# EAGLE design MainBoard 1.5.2 (EAGLE 9.6.2)
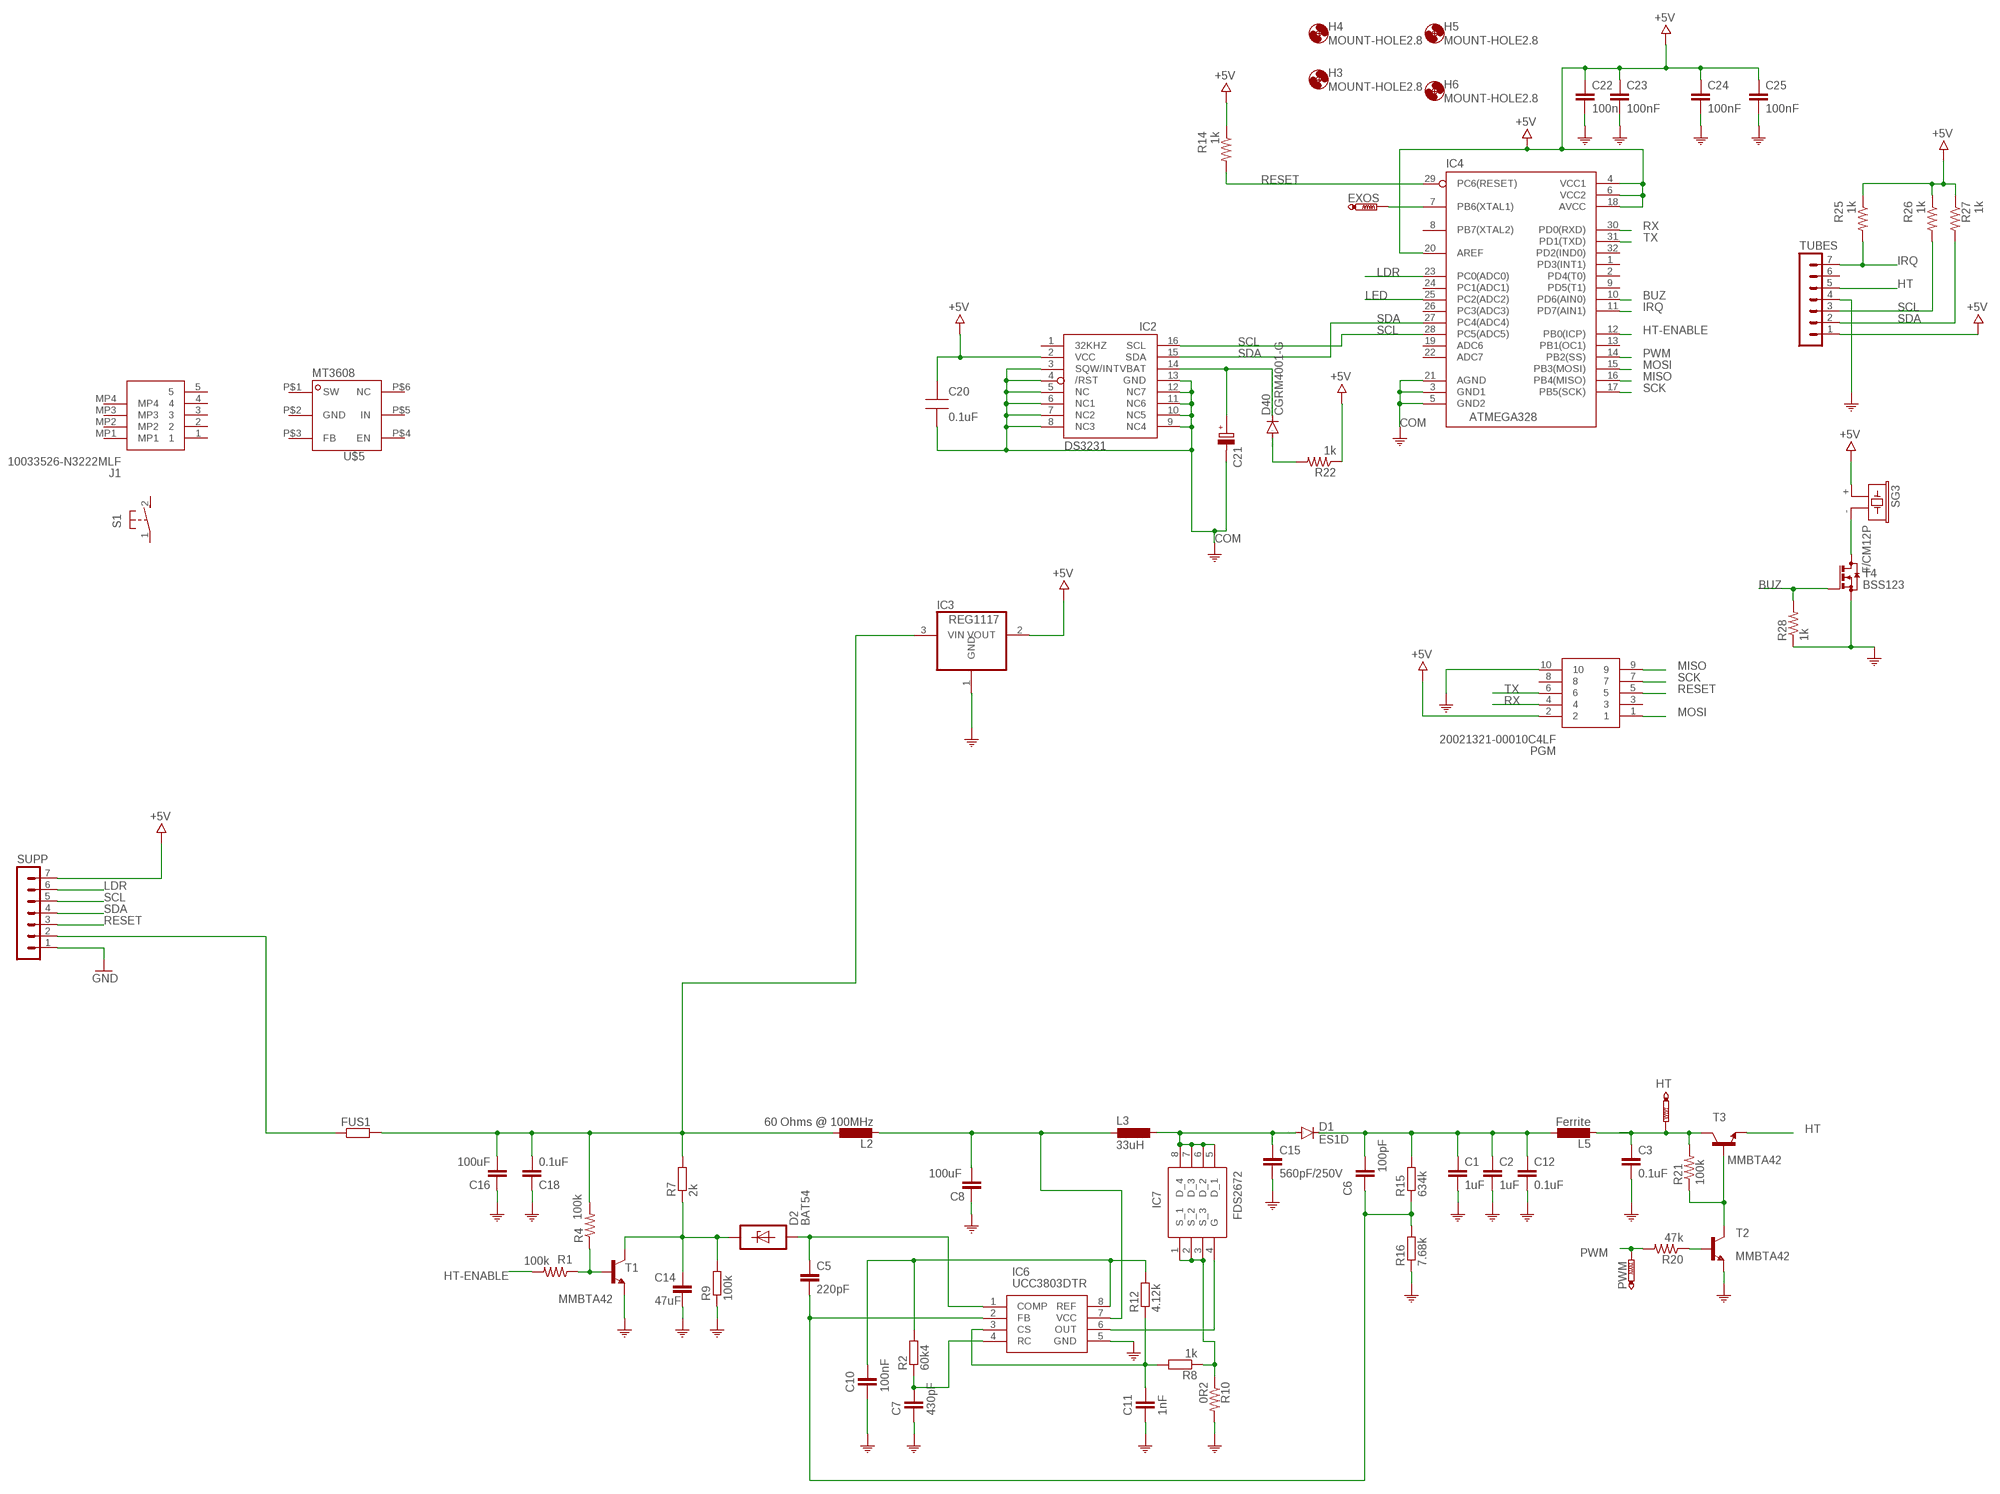
[diagram p0: schematic, sheet 1]

## Parts
C1  1uF  C-EUC1812K  [C1812K]
C2  1uF  C-EUC1812K  [C1812K]
C3  0.1uF  C-EUC1808  [C1808]
C5  220pF  C-EUC0805K  [C0805K]
C6  100pF  C-EUC0805  [C0805]
C7  430pF  C-EUC0805  [C0805]
C8  100uF  C-EUC1210  [C1210]
C10  100nF  C-EUC0805  [C0805]
C11  1nF  C-EUC0805  [C0805]
C12  0.1uF  C-EUC1808  [C1808]
C14  47uF  C-EUC1210  [C1210]
C15  560pF/250V  C-EUC0603  [C0603]
C16  100uF  C-EUC1210  [C1210]
C18  0.1uF  C-EUC0805  [C0805]
C20  0.1uF  CAP0805-NP  [CAP0805-NP]
C21  AHG-35/100-RADIAL  [ELNA21.5X8.0]
C22  100n  C-EUC0603  [C0603]
C23  100nF  C-EUC0603  [C0603]
C24  100nF  C-EUC0603  [C0603]
C25  100nF  C-EUC0603  [C0603]
D1  ES1D  ES2D  [SMB]
D2  BAT54  SP4020-01FTG  [SOD323]
D40  CGRM4001-G  [SOD-123_MINI-SMA]
EXOS  PTR1TP09R  [TP09R]
FUS1  R-EU_R6332  [R6332]
H3  MOUNT-HOLE2.8  [2,8]
H4  MOUNT-HOLE2.8  [2,8]
H5  MOUNT-HOLE2.8  [2,8]
H6  MOUNT-HOLE2.8  [2,8]
HT  PTR1TP09R  [TP09R]
IC2  DS3231/SO  [SO16W]
IC3  REG1117  [SOT223]
IC4  ATMEGA328  ATMEGA168-20AU  [QFP032]
IC6  UCC3803DTR  [SOIC127P600X175-8N]
IC7  FDS2672  [SOIC127P600X175-8N]
J1  10033526-N3222MLF  [10033526N3222MLF]
L2  60 Ohms @ 100MHz  L-EUL2012C  [L2012C]
L3  33uH  MSS7341  [MSS7341]
L5  Ferrite  L-EUL2012C  [L2012C]
PGM  20021321-00010C4LF  [2002132100010C4LF]
PWM  PTR1TP09R  [TP09R]
R1  100k  R-US_R0805  [R0805]
R2  60k4  R-EU_R0805  [R0805]
R4  100k  R-US_R0805  [R0805]
R7  2k  R-EU_R0805  [R0805]
R8  1k  R-EU_R0805  [R0805]
R9  100k  R-EU_R0805  [R0805]
R10  0R2  R-US_R2010  [R2010]
R12  4.12k  R-EU_R0805  [R0805]
R14  1k  R-US_M2012  [M2012]
R15  634k  R-EU_R0805  [R0805]
R16  7.68k  R-EU_R0805  [R0805]
R20  47k  R-US_R2012  [R2012]
R21  100k  R-US_R2012  [R2012]
R22  1k  R-US_M2012  [M2012]
R25  1k  R-US_M2012  [M2012]
R26  1k  R-US_M2012  [M2012]
R27  1k  R-US_M2012  [M2012]
R28  1k  R-US_M2012  [M2012]
S1  31-XX  [B3F-31XX]
SG3  F/CM12P  [F/CM12P]
SUPP  MA07-1  [MA07-1]
T1  MMBTA42  BC846  [SOT23]
T2  MMBTA42  BC846  [SOT23]
T3  MMBTA42  BC846  [SOT23]
T4  BSS123  [SOT23]
TUBES  MA07-1  [MA07-1]
U$5  MT3608SOT23-6  [SOT23-6]

## Nets
+5V [pwr]: C20.1 C22.1 C23.1 C24.1 C25.1 IC2.2(VCC) IC3.2(VOUT) IC4.4(VCC1) IC4.6(VCC2) IC4.18(AVCC) IC4.20(AREF) PGM.2 R14.1 R22.1 R25.1 R26.1 R27.1 SG3.+ SUPP.7 TUBES.1
BATT: C21.+ D40.C IC2.14(VBAT)
BUZ: IC4.10(PD6(AIN0)) R28.2 T4.1(G)
COM: C1.2 C2.2 C3.2 C7.2 C8.1 C10.2 C11.2 C12.2 C14.2 C15.2 C16.1 C18.2 C20.2 C21.- C22.2 C23.2 C24.2 C25.2 IC2.3(SQW/INT) IC2.4(/RST) IC2.5(NC) IC2.6(NC1) IC2.7(NC2) IC2.8(NC3) IC2.9(NC4) IC2.10(NC5) IC2.11(NC6) IC2.12(NC7) IC2.13(GND) IC3.1(GND) IC4.3(GND1) IC4.5(GND2) IC4.21(AGND) IC6.5(GND) PGM.10 R9.1 R10.2 R16.1 R28.1 SUPP.1 T1.2(E) T2.2(E) T4.2(S) TUBES.4 ; supply symbol labelled GND
CS: C11.1 IC6.3(CS) R8.2 R12.1
FB: C5.2 C6.2 IC6.2(FB) R15.1 R16.2
HT: T3.2(E) TUBES.5
HT-ENABLE: IC4.12(PB0(ICP)) R1.2
IRQ: IC4.11(PD7(AIN1)) R25.2 TUBES.7
LDR: IC4.23(PC0(ADC0)) SUPP.6
LED: IC4.25(PC2(ADC2))
MISO: IC4.16(PB4(MISO)) PGM.9
MOSI: IC4.15(PB3(MOSI)) PGM.1
N$3: SG3.- T4.3(D)
N$5: EXOS.TP IC4.7(PB6(XTAL1))
N$6: C1.1 C2.1 C6.1 C12.1 D1.C L5.1 R15.2
N$7: R21.1 T2.3(C) T3.1(B)
N$8: R1.1 R4.1 T1.1(B)
N$9: C14.1 D2.C R7.1 R9.2 T1.3(C)
N$10: C5.1 D2.A IC6.1(COMP)
N$12: IC7.1(S_1) IC7.2(S_2) IC7.3(S_3) R8.1 R10.1
N$14: C8.2 IC6.7(VCC) L2.2 L3.1
N$18: C15.1 D1.A IC7.5(D_1) IC7.6(D_2) IC7.7(D_3) IC7.8(D_4) L3.2
N$19: R20.1 T2.1(B)
N$23: D40.A R22.2
OUT: IC6.6(OUT) IC7.4(G)
POSTFUSE [pwr]: C16.2 C18.1 FUS1.2 IC3.3(VIN) L2.1 R4.2 R7.2
PWM: IC4.14(PB2(SS)) PWM.TP R20.2
RAW_HT: C3.1 HT.TP L5.2 R21.2 T3.3(C)
RC: C7.1 IC6.4(RC) R2.1
REF: C10.1 IC6.8(REF) R2.2 R12.2
RESET: IC4.29(PC6(RESET)) PGM.5 R14.2 SUPP.3
RX: IC4.30(PD0(RXD)) PGM.4
SCK: IC4.17(PB5(SCK)) PGM.7
SCL: IC2.16(SCL) IC4.28(PC5(ADC5)) R26.2 SUPP.5 TUBES.3
SDA: IC2.15(SDA) IC4.27(PC4(ADC4)) R27.2 SUPP.4 TUBES.2
TX: IC4.31(PD1(TXD)) PGM.6
VBUS: FUS1.1 SUPP.2
Unconnected: IC2.1(32KHZ) IC4.1(PD3(INT1)) IC4.2(PD4(T0)) IC4.8(PB7(XTAL2)) IC4.9(PD5(T1)) IC4.13(PB1(OC1)) IC4.19(ADC6) IC4.22(ADC7) IC4.24(PC1(ADC1)) IC4.26(PC3(ADC3)) IC4.32(PD2(IND0)) J1.1 J1.2 J1.3 J1.4 J1.5 J1.MP1 J1.MP2 J1.MP3 J1.MP4 PGM.3 PGM.8 S1.1(P) S1.2(S) TUBES.6 U$5.P$1(SW) U$5.P$2(GND) U$5.P$3(FB) U$5.P$4(EN) U$5.P$5(IN) U$5.P$6(NC)

## Library data of the parts
C1 C2 = rcl:C-EU: CAPACITOR, European symbol; MOUSER: 810-C4532X7T2E105MST; SPICEPREFIX: C; TDK: C4532X7T2E105M250KE
C3 C12 = rcl:C-EU: CAPACITOR, European symbol; KEMET: CAN17C104KARACTU; MOUSER: 80-CAN17C104KARACTU; SPICEPREFIX: C
C5 C14 C15 C18 C22-C25 = rcl:C-EU: CAPACITOR, European symbol; SPICEPREFIX: C
C6 C7 C10 C11 = rcl:C-EU: CAPACITOR, European symbol; MOUSER: 791-0603X106K100CT; SPICEPREFIX: C
C8 C16 = rcl:C-EU: CAPACITOR, European symbol; MOUSER: 963-EMK325ABJ107MM-P; SPICEPREFIX: C; TAIYO_YUDEN: EMK325ABJ107MM-P
C20 = MySMD:CAP0805-NP
C21 = Elkos:AHG-35/100-RADIAL: AUDYN® - AHG Gepolt, radial High Grade AHG Gepolter Elekrolytkondensator für Audio-Netzteile, oder Verstärker im Home- und Car-Bereich. Technische Daten Anschlußdrähte: Kupfer, verzinnt AL: ? mm d2ø : ? mm Kapazitätsbereich: von 10 µF bis 2200 µF Nennspannungen: 25 V, 35 V, 50 V, 100 V C-Toleranz: 20 % ( bei 20° C ) Verlustfaktor: tan δ < 0,100 @ 1 kHz Temperaturbereich: - 40° C bis 85° C Verzerrung: sehr gering bei 10 kHz, 010 A - 120 dB oder niedriger gepolt AHG AUDYN® - AHG gepolt Bezeichnung C U DxH Rm Bestell.-Nr. U / Volt D x L/mm mm AHG/10.0/100V 10µF 100V 10x15 5,0 1341690 AHG/22.0/50V 22µF 50V 10x13 5,0 1341691 AHG/47.0/50V 47µF 50V 10x16 5,0 1341692 AHG/100.0/50V 100µF 50V 13x21 5,0 1341693 AHG/220.0/50V 220µF 50V 16x25 7,5 1341694 AHG/470.0/50V 470µF 50V 16x37 7,5 1341695 AHG/1000/35V 1000µF 35V 18x37 7,5 1341696 AHG/2200/35V 2200µF 35V 22x38 10,0 1341697 Alle Abmessungen in mm; MOUSER: 555-DB-5R5D474T
D1 = diode:ES2D: DIODE super fast rectifier, 2 A
D2 = sp4020_11:SP4020-01FTG: SP4020 Series 2.5pF, 30A Discrete TVS Diode Source: http://www.littelfuse.com/~/media/electronics/datasheets/tvs_diode_arrays/littelfuse_tvs_diode_array_sp4020_datasheet.pdf.pdf; MF: Littelfuse; MPN: SP4020-01FTG; OC_FARNELL: unknown; OC_NEWARK: 05X0400
D40 = diode:CGRM400*-G: Molded plasitc,JEDEC SOD-123/Mini SMA Source: Comchip CGRM4001-G.pdf; MOUSER: 863-NSR0320MW2T1G
EXOS HT PWM = testpad:PTR1: TEST PIN
FUS1 = rcl:R-EU_: RESISTOR, European symbol; MOUSER: 530-0ZCG0150AF2C; SPICEPREFIX: R
H3-H6 = holes:MOUNT-HOLE: MOUNTING HOLE with drill center marker
IC2 = DS3231:DS3231; AVAILABILITY: Unavailable; MF: Maxim Integrated; MOUSER: 700-DS3231S#; MP: DS3231; PACKAGE: SOIC-16 Maxim Integrated; PRICE: None
IC3 = burr-brown:REG1117: 800mA and 1A Low Dropout (LDO) Positive Regulator 1.8V, 2.5V, 2.85V, 3.3V, 5V, and Adj; MPN: REG1117; OC_FARNELL: 1097566; OC_NEWARK: 14P6981
IC4 = MySMD:ATMEGA168-20AU
IC6 = UCC3803DTR:UCC3803DTR: Switching Controllers Low-Power BiCMOS Current-Mode PWM Source: Datasheet <http://www.ti.com/lit/ds/symlink/ucc3803.pdf>; DESCRIPTION: Switching Controllers Low-Power BiCMOS Current-Mode PWM; HEIGHT: 1.75mm; MANUFACTURER_NAME: Texas Instruments; MANUFACTURER_PART_NUMBER: UCC3803DTR; MOUSER_PART_NUMBER: 595-UCC3803DTR; MOUSER_PRICE-STOCK: https://www.mouser.com/Search/Refine.aspx?Keyword=595-UCC3803DTR
IC7 = FDS2672:FDS2672: FDS2672, N-channel MOSFET Transistor 3.9 A 200 V, 8-Pin SOIC Source: Datasheet <http://docs-emea.rs-online.com/webdocs/0d23/0900766b80d23481.pdf>; DESCRIPTION: FDS2672, N-channel MOSFET Transistor 3.9 A 200 V, 8-Pin SOIC; HEIGHT: 1.75mm; MANUFACTURER_NAME: Fairchild Semiconductor; MANUFACTURER_PART_NUMBER: FDS2672; MOUSER_PART_NUMBER: 512-FDS2672; MOUSER_PRICE-STOCK: https://www.mouser.com/Search/Refine.aspx?Keyword=512-FDS2672; RS_PART_NUMBER: 6710481P; RS_PRICE-STOCK: http://uk.rs-online.com/web/p/products/6710481P
J1 = SamacSys_Parts:10033526-N3222MLF: USB Connectors 10033526-N3222MLF-MINI USB B TYPE RECEPT. Source: Datasheet <https://componentsearchengine.com/Datasheets/1/10033526-N3222MLF.pdf>; DESCRIPTION: USB Connectors 10033526-N3222MLF-MINI USB B TYPE RECEPT.; HEIGHT: 3.95mm; MANUFACTURER_NAME: Amphenol; MANUFACTURER_PART_NUMBER: 10033526-N3222MLF; MOUSER_PART_NUMBER: 649-10033526N3222MLF; MOUSER_PRICE-STOCK: https://www.mouser.co.uk/ProductDetail/Amphenol-FCI/10033526-N3222MLF?qs=LmzVcvYPptRriY26yhJP4g%3D%3D
L2 L5 = rcl:L-EU: INDUCTOR, European symbol; SPICEPREFIX: L
L3 = STEAM-inductor-coilcraft:MSS7341: Shielded Power Inductors Package 6.6 × 6.6 mm x 4.1 mm high Source: http://www.farnell.com/datasheets/1681958.pdf; MOUSER: 710-784770330
PGM = SamacSys_Parts:20021321-00010C4LF: Headers & Wire Housings 1.27x1.27mm BTB, Hdr Recept, SMT, 10 Pos Source: Datasheet <https://componentsearchengine.com/Datasheets/1/20021321-00010C4LF.pdf>; DESCRIPTION: Headers & Wire Housings 1.27x1.27mm BTB, Hdr Recept, SMT, 10 Pos; HEIGHT: 4.75mm; MANUFACTURER_NAME: Amphenol; MANUFACTURER_PART_NUMBER: 20021321-00010C4LF; MOUSER_PART_NUMBER: 649-202132100010C4LF; MOUSER_PRICE-STOCK: https://www.mouser.com/Search/Refine.aspx?Keyword=649-202132100010C4LF
R1 R4 R10 R14 R20-R22 R25-R28 = adafruit:R-US_: RESISTOR, American symbol
R2 R8 R9 = rcl:R-EU_: RESISTOR, European symbol; SPICEPREFIX: R
R7 = rcl:R-EU_: RESISTOR, European symbol; MOUSER: 754-RR1220P-202D; SPICEPREFIX: R; SUSUMU: RR1220P-202-D
R12 = rcl:R-EU_: RESISTOR, European symbol; KOASPEER: RN732ATTD4121F100; MOUSER: 660-RN732ATD4121F100; SPICEPREFIX: R
R15 = rcl:R-EU_: RESISTOR, European symbol; MOUSER: 71-CRCW0603-634K-E3; SPICEPREFIX: R; VISHAY: CRCW0603634KFKEA
R16 = rcl:R-EU_: RESISTOR, European symbol; MOUSER: 71-CRCW0805-7.68K-E3; SPICEPREFIX: R; VISHAY: CRCW08057K68FKEA
S1 = switch-omron:31-XX: OMRON SWITCH; MPN: B3F-3100; OC_FARNELL: 959704; OC_NEWARK: 36M3582
SG3 = buzzer:F/CM12P: BUZZER Source: Buerklin; OC_FARNELL: unknown; OC_NEWARK: unknown
SUPP TUBES = con-lstb:MA07-1: PIN HEADER; OC_FARNELL: unknown; OC_NEWARK: unknown
T1-T3 = transistor:BC846: NPN TRANSISTOR
T4 = transistor-small-signal:BSS123: N-CHANNEL MOS FET
U$5 = MT3608:MT3608: MT3608 High Efficiency 1.2MHz 2A Step Up Converter BY: Rangana Tennakoon

## Module TUBEIN16
Ports: 

### Library data of the parts

## Net classes
0 default: width 0.254 mm, clearance 0.254 mm
1 pwr: width 0.254 mm, clearance 0.356 mm

## Board
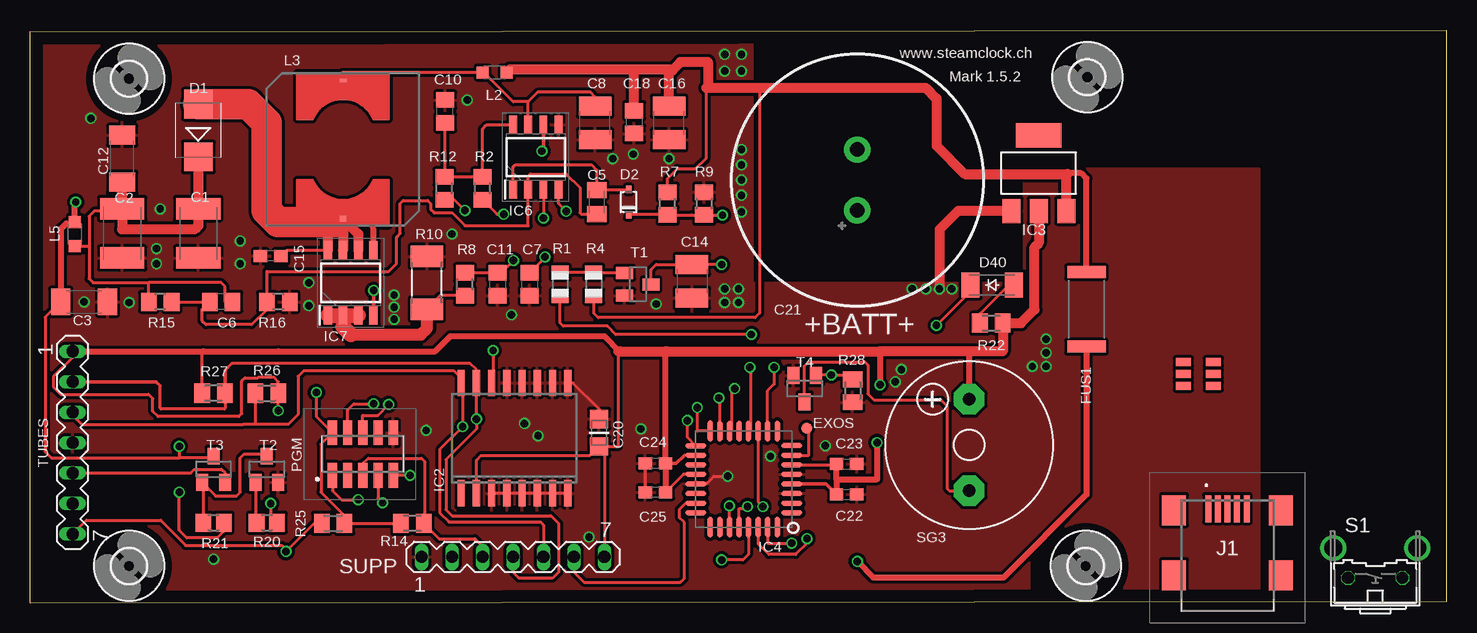
[diagram p1: board, top side]
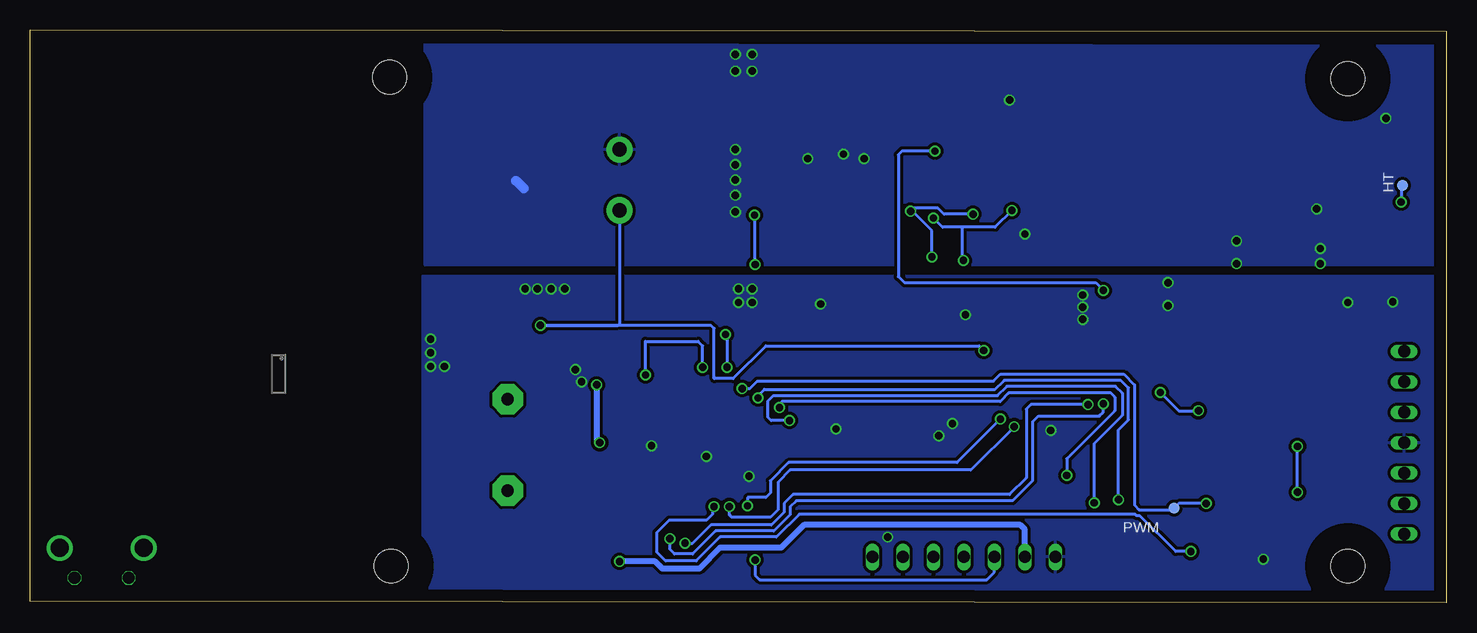
[diagram p2: board, bottom side, seen from below]

Size 118.11 x 47.75 mm. Coordinates in mm from the lower left corner, seen from the top.
Outline: 0,47.62 118.11,47.75 118.11,0.13 0,0 0,47.62
Copper layers (1*16): Top 0.035mm / dielectric 1.5mm / Bottom 0.035mm
Design rules "default *": minimum track width 10mil, minimum drill 24mil, track to track 4mil, track to pad 1mil, pad to pad 1mil, via to via 8mil, smd to smd 8mil, copper to edge 40mil, drill to drill 8mil, minimum pad ring 1mil, minimum via ring 3mil, stop-mask expansion 4mil, vias tented up to drill 0mil, thermal gap 10mil

### Footprints (pad centres in the part's own frame; a part is rotated, then mirrored left to right if it is on the bottom)
C1812K = smd 1.8 x 3.7: 1 -2.05,0; 2 2.05,0
C1808 = smd 1.6 x 2.2: 1 -1.95,0; 2 1.95,0
C0805K = smd 1.3 x 1.6: 1 -1,0; 2 1,0
C0805 = smd 1.3 x 1.5: 1 -0.95,0; 2 0.95,0
C1210 = smd 1.6 x 2.7: 1 -1.4,0; 2 1.4,0
C0603 = smd 1.1 x 1: 1 -0.85,0; 2 0.85,0
CAP0805-NP = smd 1.524 x 1.524: 1 0,0; 2 2.286,0
ELNA21.5X8.0 = drill 1.2 pad 2.184: + -2.54,0; - 2.54,0
SMB = smd 2.4 x 2.4: A 2.2,0; C -2.2,0
SOD323 = smd 0.6 x 0.45: A 1.06,0; C -1.06,0
SOD-123_MINI-SMA = smd 1.5 x 2.1: A 1.8,0; C -1.8,0
TP09R = smd 0.9 x 0.9: TP 0,0
R6332 = smd 1 x 3.2: 1 -3.1,0; 2 3.1,0
2,8 = hole 2.8: 0,0
SO16W = smd 0.6 x 2.2: 1 -4.445,-4.6; 2 -3.175,-4.6; 3 -1.905,-4.6; 4 -0.635,-4.6; 5 0.635,-4.6; 6 1.905,-4.6; 7 3.175,-4.6; 8 4.445,-4.6; 9 4.445,4.6; 10 3.175,4.6; 11 1.905,4.6; 12 0.635,4.6; 13 -0.635,4.6; 14 -1.905,4.6; 15 -3.175,4.6; 16 -4.445,4.6
SOT223 = smd 1.499 x 2.007: 1 -2.261,-3.15; 2 0.025,-3.15; 3 2.311,-3.15 | smd 3.81 x 2.007: 4 0,3.15
QFP032 = smd 0.432 x 1.778: 1 0,0; 2 0.8,0; 3 1.599,0; 4 2.399,0; 5 3.199,0; 6 3.998,0; 7 4.798,0; 8 5.598,0; 17 5.588,8.001; 18 4.798,7.997; 19 3.998,7.997; 20 3.199,7.997; 21 2.399,7.997; 22 1.599,7.997; 23 0.799,7.997; 24 0,7.997 | smd 1.778 x 0.432: 9 6.807,1.194; 10 6.807,2.007; 11 6.807,2.794; 12 6.807,3.607; 13 6.807,4.394; 14 6.807,5.182; 15 6.807,5.994; 16 6.816,6.803; 25 -1.194,6.807; 26 -1.194,5.994; 27 -1.194,5.182; 28 -1.194,4.394; 29 -1.194,3.607; 30 -1.194,2.794; 31 -1.194,2.007; 32 -1.194,1.194
SOIC127P600X175-8N = smd 1.525 x 0.65: 1 -2.712,1.905; 2 -2.712,0.635; 3 -2.712,-0.635; 4 -2.712,-1.905; 5 2.712,-1.905; 6 2.712,-0.635; 7 2.712,0.635; 8 2.712,1.905
SOIC127P600X175-8N' = smd 1.525 x 0.7: 1 -2.712,1.905; 2 -2.712,0.635; 3 -2.712,-0.635; 4 -2.712,-1.905; 5 2.712,-1.905; 6 2.712,-0.635; 7 2.712,0.635; 8 2.712,1.905
10033526N3222MLF = smd 0.5 x 2.25: 1 -1.6,5.545; 2 -0.8,5.545; 3 0,5.545; 4 0.8,5.545; 5 1.6,5.545 | smd 2 x 2.5: MP1 -4.45,5.42; MP2 -4.45,0; MP3 4.45,0; MP4 4.45,5.42
L2012C = smd 1 x 1: 1 -1,0; 2 1,0
MSS7341 = smd 0.61 x 0.305: 1 0,5.765 | smd 0.5 x 0.5: 2 0,-5.765
2002132100010C4LF = smd 0.76 x 2.05: 1 2.54,1.775; 2 2.54,-1.775; 3 1.27,1.775; 4 1.27,-1.775; 5 0,1.775; 6 0,-1.775; 7 -1.27,1.775; 8 -1.27,-1.775; 9 -2.54,1.775; 10 -2.54,-1.775
R0805 = smd 1.1 x 1.4: 1 -1,0; 2 1,0
R0805' = smd 1.3 x 1.5: 1 -0.95,0; 2 0.95,0
R2010 = smd 1.8 x 2.7: 1 -2.2,0; 2 2.2,0
M2012 = smd 1.3 x 1.6: 1 -0.95,0; 2 0.95,0
R2012 = smd 1.3 x 1.5: 1 -0.85,0; 2 0.85,0
B3F-31XX = drill 1.016 octagon: 1 -2.261,-1.245; 2 2.261,-1.245 | drill 1.499 pad 2.159: 3 -3.505,1.245; 4 3.505,1.245
F/CM12P = drill 1.016 pad 2.54 octagon: + 3.81,0; - -3.81,0
MA07-1 = drill 1.016 long: 1 -7.62,0; 2 -5.08,0; 3 -2.54,0; 4 0,0; 5 2.54,0; 6 5.08,0; 7 7.62,0
SOT23 = smd 1 x 1.4: 1 -0.95,-1.1; 2 0.95,-1.1; 3 0,1.1
SOT23-6 = smd 1.27 x 0.635: P$1 0,0; P$2 0,-1; P$3 0,-2; P$4 2.5,-2; P$5 2.5,-1; P$6 2.5,0

### Placement (x,y rotation side)
C1  14.03,30.8 270 top
C2  7.68,30.8 270 top
C3  4.51,25.08 0 top
C5  47.24,33.4 270 top
C6  15.94,25.08 180 top
C7  41.66,26.54 270 top
C8  47.12,40.01 90 top
C10  34.61,40.96 90 top
C11  38.99,26.54 270 top
C12  7.68,37.02 90 top
C14  55.18,26.8 270 top
C15  20.07,28.89 180 top
C16  53.28,40.01 90 top
C18  50.36,40.07 270 top
C20  47.43,13.02 90 top
C21  68.96,35.24 90 top
C22  68.07,9.02 0 top
C23  68.07,11.56 0 top
C24  52.13,11.62 180 top
C25  52.13,9.21 180 top
D1  14.03,39.37 90 top
D2  49.91,33.4 90 top
D40  80.2,26.48 0 top
EXOS  64.77,14.54 0 top
FUS1  88.07,24.45 90 top
H3  8.26,43.69 0 top
H4  8.26,3.05 0 top
H5  88.01,3.05 0 top
H6  88.14,43.82 0 top
HT  3.68,34.8 0 bottom
IC2  40.39,13.72 0 top
IC3  84.07,35.81 0 top
IC4  63.5,7.49 90 top
IC6  42.16,37.15 90 top
IC7  FDS2672  [SOIC127P600X175-8N']  26.73,26.67 90 top
J1  99.82,2.29 0 top
L2  38.73,44.2 180 top
L3  26.1,37.78 0 top
L5  3.75,30.73 90 top
PGM  27.75,12.38 180 top
PWM  22.73,7.87 0 bottom
R1  44.2,26.54 270 top
R2  60k4  [R0805']  37.72,34.54 90 top
R4  46.99,26.54 270 top
R7  2k  [R0805']  53.15,33.27 90 top
R8  1k  [R0805']  36.26,26.54 90 top
R9  100k  [R0805']  56.2,33.27 270 top
R10  33.08,26.67 90 top
R12  4.12k  [R0805']  34.54,34.54 90 top
R14  31.88,6.6 0 top
R15  634k  [R0805']  10.86,25.08 180 top
R16  7.68k  [R0805']  20.7,25.08 180 top
R20  19.75,6.67 0 top
R21  15.3,6.67 0 top
R22  80.14,23.3 180 top
R25  25.27,6.6 180 top
R26  19.75,17.46 180 top
R27  15.3,17.46 0 top
R28  68.58,17.65 90 top
S1  112.14,3.3 0 top
SG3  78.3,13.14 90 top
SUPP  40.26,3.81 0 top
T1  50.67,26.54 270 top
T2  19.75,11.11 0 top
T3  15.3,11.11 0 top
T4  64.58,17.84 180 top
TUBES  3.56,13.33 270 top
U$5  96.14,20.07 0 top

### Tracks (layer width: path | path; a pad name or v marks a point on that pad's centre or on a via)
+5V  (via drill 0.61)
  Top 0.254: C20.1 46.67,12.26 37.59,12.26 37.21,11.87 IC2.2 | C20.1 49.02,13.02 49.02,20.95 | IC4.20 54.47,10.69 C25.1 | 20.7,20.95 | 14.48,20.95 14.35,20.83 R27.1 | IC4.18 54.54,12.29 | C24.1 52.98,20.85 53.09,20.95 | IC4.6 67.16,11.49 | TUBES.1 3.56,20.45 1.96,18.85 1.96,17.98 2.57,17.37 9.89,17.37 10.25,17.02 10.25,15.94 10.68,15.51 17.41,15.51 17.67,15.76 17.67,18.46 17.95,18.74 19,18.74 19.05,18.8 20.32,18.8 20.7,18.41 R26.1 v20.7,16 | R14.1 R25.1 26.22,7.24 24.27,9.2 24.27,13.22 PGM.2 23.88,15.49 v23.88,17.53 | C20.1 47.88,12.57 SUPP.7
  Top 0.305: IC4.4 66.35,9.89 C22.1 | 67.16,11.49 C23.1 | C24.1 53.87,11.62 54.54,12.29
  Top 0.508: C25.1 C24.1 52.98,20.95 | TUBES.1 14.48,20.95 20.7,20.95 33.78,20.95 35.05,22.23 47.88,22.23 49.15,20.95 | 67.22,10.29 C22.1 | 70.87,20.95 v70.87,18.16 | v70.61,13.33 70.61,10.29 67.22,10.29 | SG3.+ 78.3,20.89 78.36,20.95 | 67.22,10.29 C23.1
  Top 0.813: IC3.2 84.1,30 83.74,29.64 83.74,24.44 82.61,23.3 R22.1 81.09,20.95 78.36,20.95 70.87,20.95 53.09,20.95 | 49.02,20.95 49.15,20.95 52.98,20.95
  Bottom 0.254: v23.88,17.53 22.35,16 v20.7,16
  Bottom 0.508: v70.87,18.16 70.87,13.59 v70.61,13.33
BATT  (via drill 0.61)
  Top 0.254: v38.61,21.02 38.61,18.44 IC2.14 | D40.C 78.4,25.95 v75.56,23.11
  Bottom 0.254: v38.61,21.02 38.99,21.4 56.77,21.4 59.5,18.67 61.09,18.67 61.09,22.86 61.34,23.11 v75.56,23.11 69.09,23.11 68.96,23.24 C21.+
BUZ  (via drill 0.61)
  Top 0.254: IC4.10 61.49,17.68 62.04,18.23 v62.04,19.62 | v66.8,18.99 66.86,18.99 | v66.8,18.99 68.58,18.99 R28.2 | v66.8,18.99 65.57,18.99 T4.1
  Bottom 0.254: v66.8,18.99 66.8,21.78 62.42,21.78 62.04,21.4 v62.04,19.62
COM  (via drill 0.61)
  Top 0.254: IC2.8 IC2.7 IC2.6 IC2.5 IC2.4 IC2.3 | IC2.9 45.25,18.32 47.44,16.13 C20.2 | C24.2 C25.2 | T2.2 | IC4.21 55.6,9.99 56.47,9.99 57.01,10.54 v58.17,10.54
  Top 0.813: IC3.1 77.37,32.66 75.82,31.12 v75.82,26.16
  Bottom 0.813: 77.6,35.18 76.96,34.54
  other vias: 15.3,3.62 5.08,40.39 17.53,28.26 10.54,28.26 4.51,25.08 10.86,32.83 10.54,29.53 17.53,30.16 23.24,26.67 23.24,24.77 30.35,24.64 30.35,23.62 57.91,44.32 59.31,44.32 59.31,37.78 59.31,33.97 59.31,35.24 59.31,32.58 35.18,30.73 40.13,24 57.91,45.72 59.31,36.51 30.35,25.65 59.31,45.72 41.21,14.92 42.35,13.91 48.58,37.02 53.28,37.02 50.29,37.4 52.2,24.89 36.45,41.91 57.91,26.16 73.53,26.16 76.83,26.16 59.05,26.16 57.91,25.02 59.05,25.02 50.93,14.48 8.26,25.02 74.68,26.16 83.57,19.69 84.71,21.97 84.71,19.69 84.71,20.83 66.29,13.08 72.14,18.41 72.64,19.43 61.72,12.19 33.02,14.35 46.61,5.46
  pour Top: -1.52,46.67 60.2,46.67 60.2,23.49 -1.52,23.49
  pour Bottom: -4.06,27.24 -4.06,-5.14 85.34,-5.14 85.34,27.24
  pour Top: -3.75,26.61 -3.75,-4.06 83.31,-4.06 83.31,26.61
  pour Bottom: 85.22,46.67 85.22,28.19 -1.52,28.19 -1.52,46.67
  pour Top: 82.87,36.13 82.87,-4.7 102.49,-4.7 102.49,36.13
CS  (via drill 0.61)
  Top 0.254: R12.1 35.37,33.59 v36.26,32.7 | R8.2 C11.1 39.25,27.49 v40.3,28.54 | IC6.3 v42.8,32.07
  Bottom 0.254: v40.3,28.54 40.39,28.63 40.39,31.3 | v36.26,32.7 37.66,31.3 40.39,31.3 | 40.39,31.3 42.04,31.3 v42.8,32.07
FB
  Top 0.254: R15.1 C6.2 14.35,24.45 14.35,23.49 14.67,23.18 18.48,23.18 19.75,24.45 R16.2 19.75,27.62 29.91,27.62 30.54,28.26 30.54,30.48 30.86,30.8 30.86,33.27 31.12,33.53 33.15,33.53 33.41,33.26 33.41,32.79 33.69,32.51 35.18,32.51 36.26,31.43 41.53,31.43 IC6.2 41.53,35.58 41.7,35.75 44.7,35.75 45.85,34.61 45.85,32.51 45.97,32.39 47.23,32.39 C5.2
HT
  Top 0.254: TUBES.5 13.4,10.79 13.7,11.09 15.92,11.09 15.94,11.11 16.25,10.8 T3.2
HT-ENABLE  (via drill 0.61)
  Top 0.254: IC4.12 60.07,14.3 60.07,19.43 60.01,19.49 v60.01,19.62 | v60.13,22.35 48.83,22.35 48.13,23.05 44.45,23.05 44.2,23.3 R1.2
  Bottom 0.254: v60.13,22.35 60.01,22.23 v60.01,19.62
IRQ  (via drill 0.61)
  Top 0.254: R25.2 23.68,6.6 v21.34,4.25 21.34,4.45 21.02,4.76 12.95,4.76 12.95,4.81 10.9,6.86 4.7,6.86 TUBES.7 | IC4.11 60.71,8.38 v61.09,8
  Bottom 0.254: v21.34,4.25 22.61,4.25 25.59,7.24 25.86,7.24 25.99,7.37 53.98,7.37 55.88,5.46 60.58,5.46 62.58,3.46 65.12,3.46 65.85,4.19 65.85,5.84 64.83,6.86 61.72,6.86 61.21,7.37 61.21,7.87 v61.09,8
LDR
  Top 0.254: IC4.23 54.66,8.29 54.11,7.74 54.11,7.11 54.55,6.67 54.55,2.02 54.23,1.7 46.18,1.7 45.34,2.54 SUPP.6
MISO  (via drill 0.61)
  Top 0.254: v31.69,10.6 v31.68,10.61 PGM.9 | IC4.16 55.63,14.31 v55.63,16.26
  Bottom 0.254: v55.63,16.26 55.63,16.57 55.44,16.76 37.23,16.76 36.54,17.46 28,17.46 27.69,17.15 27.69,16 31.69,12 v31.69,10.6
MOSI  (via drill 0.61)
  Top 0.254: PGM.1 25.21,9.33 25.97,8.57 v27.37,8.57 | IC4.15 57.53,14.33 57.53,16.95 v57.43,17.06
  Bottom 0.254: v27.37,8.57 27.37,14.42 26.54,15.24 26.54,17.91 27.18,18.54 36.89,18.54 37.66,17.78 56.9,17.78 57.43,17.25 v57.43,17.06
N$3
  Top 0.254: T4.3 64.58,19.75 64.9,20.07 69.6,20.07 69.85,19.81 69.85,17.4 70.36,16.89 75.95,16.89 76.45,16.38 76.45,9.53 76.64,9.33 SG3.-
N$5
  Top 0.254: IC4.7 64.9,12.29 64.9,14.42 EXOS.TP
N$6
  Top 0.254: C6.1 16.26,25.08 16.26,26.35 15.94,26.67 9.91,26.67 | R15.2 9.91,26.67 | 9.91,26.67 5.27,26.67 4.92,27.02 4.92,29.72 | 4,29.73 L5.1 4.9,29.73 4.92,29.72 | C2.1 7.48,32.64 5.33,32.64 4.92,32.23 4.92,29.72
  Top 0.813: D1.C C1.1 14.03,31.43 13.72,31.12 7.68,31.12 C2.1 C12.1
N$7
  Top 0.254: T2.3 19.58,12.38 17.84,12.38 17.53,12.06 17.53,9.21 17.21,8.89 15.48,8.89 T3.1 14.45,9.91 R21.1
N$8
  Top 0.254: T1.1 47.04,27.49 R4.1 R1.1
N$9  (via drill 0.61)
  Top 0.254: D2.C 53.13,32.34 R7.1 55.12,32.32 R9.2 57.59,32.32 57.66,32.26 v57.72,32.32 | T1.3 51.77,27.77 52.2,28.2 C14.1 v57.66,28.19
  Bottom 0.254: v57.72,32.32 57.72,28.26 v57.66,28.19
N$10
  Top 0.254: IC6.1 40.26,36.32 40.45,36.51 46.8,36.51 47.24,36.07 47.24,34.53 47.37,34.4 | D2.A 49.85,34.4 47.37,34.4 | 47.37,34.4 C5.1
N$12
  Top 0.254: R8.1 34.21,25.59 R10.1
  Top 1.016: 26.73,22.35 32.57,22.35 33.08,22.86 R10.1
  Top 1.27: IC7.1 IC7.2 | IC7.2 IC7.3 | 26.73,22.35 26.1,22.99 IC7.2
N$14
  Top 0.254: C8.2 47.12,42.17 46.74,42.55 42.29,42.55 41.53,41.78 IC6.7 41.53,41.77 40.28,41.77 37.85,44.2 L2.2 26.04,44.2 26.04,43.61 L3.1
N$18
  Top 0.254: C15.1 21.41,29.38 IC7.8 | L3.2 25.83,31.75 25.46,31.75 26.1,31.12 | 24.83,31.12 25.2,31.12 L3.2 | L3.2 27,32.02 27.37,32.39 28.64,31.12
  Top 0.508: IC7.5 28.64,31.12
  Top 0.813: 26.1,31.12 IC7.7 | L3.2 27.37,30.75 IC7.6 | 24.83,31.12 IC7.8
  Top 2.54: D1.A 18.18,41.57 19.75,40.01 19.75,32.7 20.7,31.75 25.46,31.75
N$19
  Top 0.254: R20.1 18.8,6.77 T2.1
N$23
  Top 0.254: D40.A 81.6,26.48 79.19,24.07 R22.2
OUT  (via drill 0.61)
  Top 0.254: 28.64,25.72 v28.64,26.04
  Top 0.305: IC7.4 28.64,25.72 | IC6.6 42.8,37.78 v42.67,37.66
  Bottom 0.254: v28.64,26.04 29.27,26.67 45.21,26.67 45.72,27.18 45.72,37.34 45.4,37.66 v42.67,37.66
POSTFUSE
  Top 0.254: R4.2 46.99,24.15 47.37,23.77 60.45,23.77 60.83,24.15 60.83,42.93 | R7.2 53.15,35.37 53.98,36.2 55.5,36.2 56.39,37.08 56.39,42.93
  Top 0.508: FUS1.2 88.08,35.37 87.63,35.81 86.55,35.81 86.49,35.75
  Top 0.813: 53.59,44.45 50.61,44.45 | 50.61,44.45 39.99,44.45 L2.1 | 50.61,44.45 50.36,44.19 C18.1 | C16.2 53.28,44.13 53.59,44.45 | 53.59,44.45 54.23,45.09 56.52,45.09 56.52,42.93 | 56.39,42.93 56.52,42.93 | 56.52,42.93 60.83,42.93 74.68,42.93 75.56,42.04 75.56,38.1 77.91,35.75 86.49,35.75 86.39,35.65 IC3.3
PWM  (via drill 0.61)
  Top 0.254: IC4.14 58.48,14.47 58.48,17.59 v58.74,17.84 | R20.2 20.07,7.2 v20.07,8.26
  Bottom 0.254: v58.74,17.84 58.1,17.84 57.47,18.48 37.78,18.48 37.21,19.05 26.92,19.05 26.04,18.16 26.04,8.13 25.65,7.75 22.86,7.75 PWM.TP 22.35,8.26 v20.07,8.26
RAW_HT  (via drill 0.61)
  Top 0.254: T3.3 15.16,12.06 12.45,12.06 | 3.68,33.27 v3.81,33.4 | R21.2 16.15,5.93 15.62,5.4 13.08,5.4 12.45,6.03 v12.45,9.21 | v12.45,13.02 12.45,12.06 | L5.2 3.66,31.65 3.05,31.65 | 12.45,12.06 1.78,12.06 1.27,12.57 1.27,23.79 C3.1
  Top 0.508: 3.05,31.65 2.56,31.16 C3.1 | L5.2 3.75,33.21 3.68,33.27
  Bottom 0.254: v12.45,9.21 v12.45,13.02 | HT.TP 3.81,34.8 v3.81,33.4
RC  (via drill 0.61)
  Top 0.254: R2.1 38.93,32.39 v39.5,32.39 | v44.7,32.64 44.07,33.27 IC6.4 | C7.1 42.93,28.76 v42.93,28.83
  Bottom 0.254: v39.5,32.39 41.91,32.39 42.43,32.91 44.44,32.91 v44.7,32.64 44.56,32.64 42.93,31.01 v42.93,28.83
REF
  Top 0.254: C10.1 34.54,39.94 R12.2 R2.2 37.72,39.49 38.04,39.82 40.26,39.82 IC6.8
RESET  (via drill 0.61)
  Top 0.254: v57.66,3.56 59.44,3.56 59.89,4.01 IC4.29 | PGM.5 27.75,11.6 28.19,12.04 32.64,12.04 32.89,11.79 32.89,6.67 R14.2 34.1,5.33 37.08,5.33 37.72,4.7 SUPP.3
  Bottom 0.254: v57.66,3.56 57.66,2.29 57.28,1.91 38.35,1.91 37.72,2.54 SUPP.3
RX  (via drill 0.61)
  Top 0.254: v28.64,16.57 26.99,16.57 26.48,16.07 PGM.4 | IC4.30 60.71,4.9 61.59,4.01 63.83,4.01 64.77,4.95 v64.77,5.33
  Bottom 0.254: v28.64,16.57 28.64,15.88 28.96,15.56 34.04,15.56 34.54,15.05 34.54,10.16 36.21,8.5 54.23,8.5 54.74,7.99 54.74,7.33 56.09,5.97 60.96,5.97 62.86,4.06 64.39,4.06 64.77,4.45 v64.77,5.33
SCK  (via drill 0.61)
  Top 0.254: v29.4,8.32 29.02,8.7 PGM.7 | IC4.17 54.8,13.78 v54.8,15.18
  Bottom 0.254: v29.4,8.32 29.4,13.27 27.05,15.62 27.05,17.46 27.62,18.03 36.68,18.03 37.45,17.27 56.13,17.27 56.58,16.83 56.58,15.44 56.32,15.18 v54.8,15.18
SCL  (via drill 0.61)
  Top 0.254: TUBES.3 3.56,15.62 4.32,14.86 17.78,14.86 18.8,14.86 | 18.8,14.86 R26.2 | IC4.28 59.11,7.82 59.82,7.82 v59.82,8 | 18.8,14.86 21.53,14.86 22.35,15.69 22.35,18.86 22.8,19.3 35.37,19.3 35.94,18.73 IC2.16 36.07,18.19 v36.07,14.67 34.16,12.76 34.16,7.49 34.92,6.73 42.55,6.73 42.8,6.48 SUPP.5
  Bottom 0.254: v59.82,8 59.82,7.3 59.63,7.11 56.39,7.11 55.75,7.75 55.75,10.03 54.74,11.05 39.69,11.05 v36.07,14.67
SDA  (via drill 0.61)
  Top 0.254: R27.2 16.25,16.19 16.19,16.13 10.92,16.13 10.86,16.19 10.86,18.1 10.54,18.41 | IC4.27 58.32,8.04 v58.29,8.06 | 16.25,19.37 16.83,19.94 36.71,19.94 37.21,19.43 IC2.15 v37.21,15.3 37.21,14.48 34.67,11.94 34.67,7.75 35.18,7.24 43.43,7.24 44.07,6.6 44.07,2.54 43.56,2.03 40.77,2.03 40.26,2.54 SUPP.4
  Top 0.305: R27.2 16.25,19.37 16.26,19.37 | 10.54,18.41 TUBES.2
  Bottom 0.254: v37.21,15.3 40.83,11.68 54.86,11.68 56.39,10.16 56.39,9.14 56.77,8.76 58.29,8.76 v58.29,8.06
TX  (via drill 0.61)
  Top 0.254: PGM.6 27.75,15.62 29.02,15.62 v29.91,16.51 | IC4.31 61.49,4.95 v63.5,4.95
  Bottom 0.254: v29.91,16.51 34.67,16.51 35.05,16.13 35.05,10.41 36.46,9 54.5,9 55.24,8.26 55.24,7.54 56.3,6.48 61.34,6.48 62.86,4.95 v63.5,4.95
VBUS  (via drill 0.61)
  Top 0.508: FUS1.1 88.08,9 81.15,2.08 70.31,2.08 v68.96,3.43
  Bottom 0.508: SUPP.2 35.18,6.1 35.56,6.48 53.59,6.48 55.5,4.57 60.57,4.57 62.32,2.83 65.38,2.83 65.99,3.43 v68.96,3.43

### Text on the board
tNames: www.steamclock.ch | Mark 1.5.2 | +BATT+